# Altium project PCB_Project1.PrjPCB
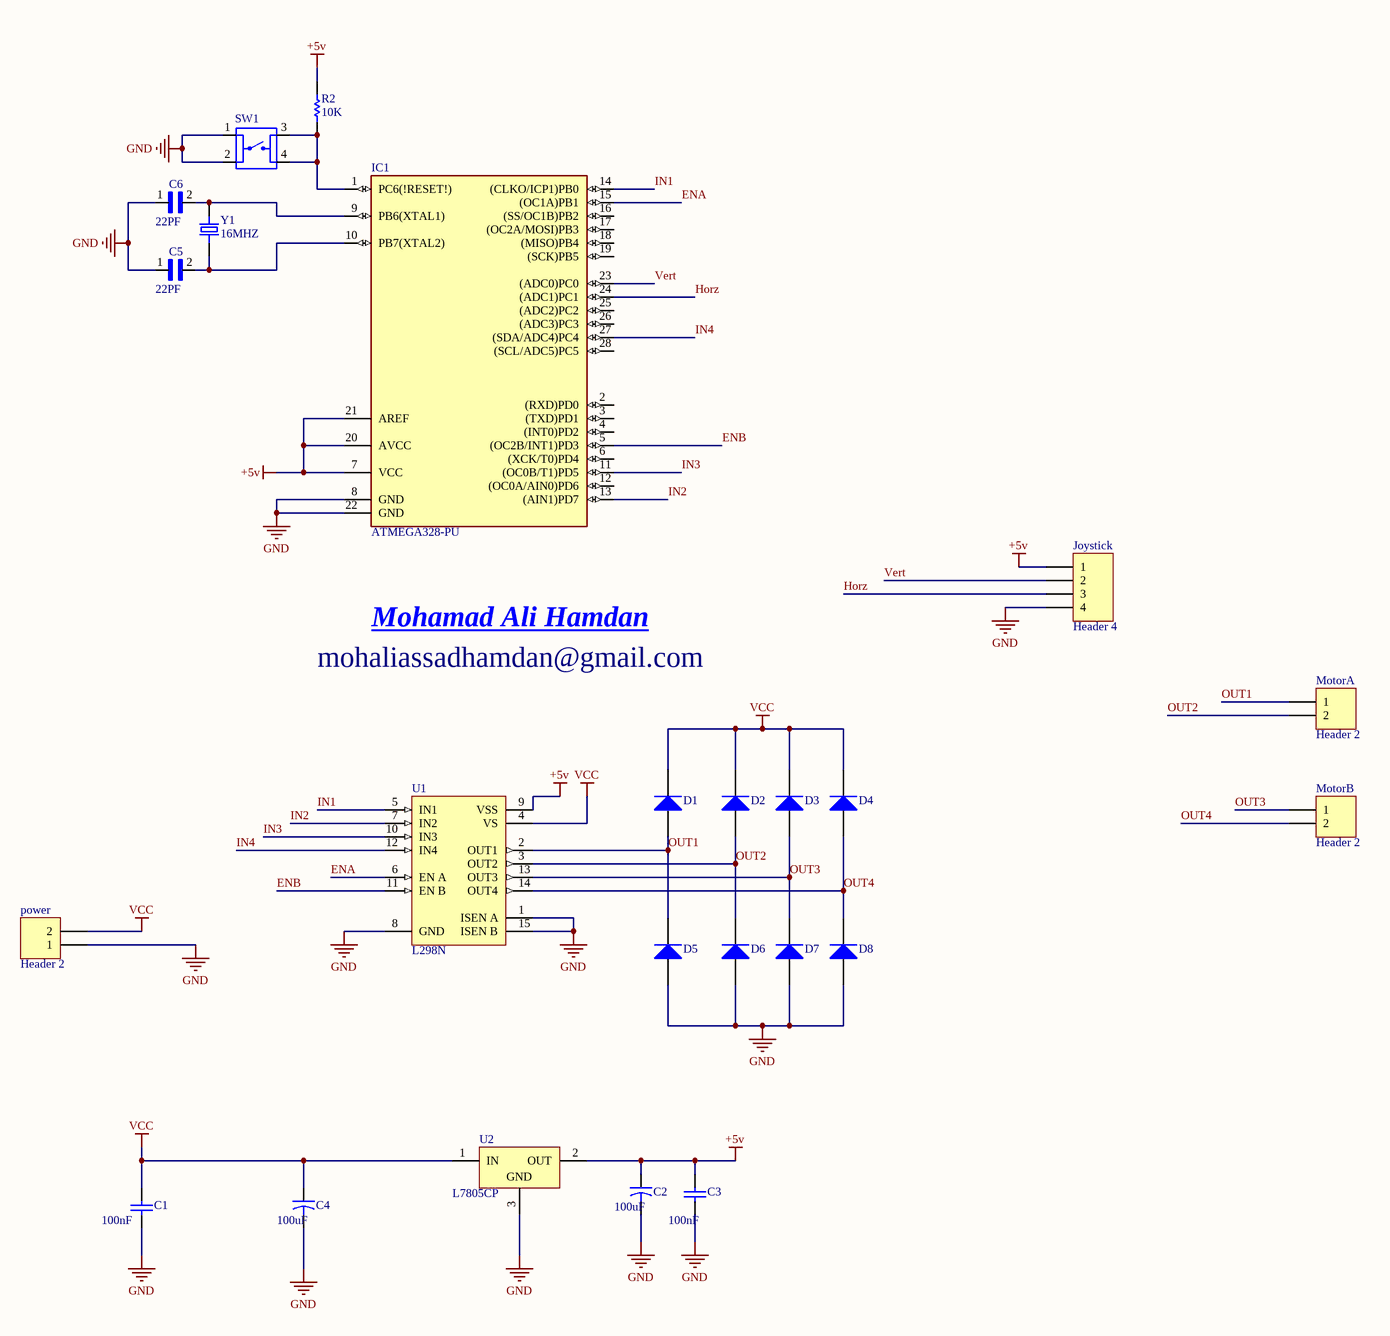
[diagram p0: Sheet1.SchDoc]
1 sheet, 24 parts. Net scope: global (net labels, ports and power ports of the same name join across sheets).
Board file: PCB1.PcbDoc

## Sheet Sheet1.SchDoc
size A3

### Parts
C1  value 100nF  [CAP_RDER71H333K0M1H03A]  (hidden comment: Cap)
C2  value 100uF  [Capacitor_pol]  (hidden comment: Cap2)
C3  value 100nF  [CAP_RDER71H333K0M1H03A]  (hidden comment: Cap)
C4  value 100uF  [Capacitor_pol]  (hidden comment: Cap2)
C5  BuyPart: 22PF  [CAP_RDER71H333K0M1H03A]  (hidden comment: 14pF)
C6  BuyPart: 22PF  [CAP_RDER71H333K0M1H03A]  (hidden comment: 14pF)
D1  Diode 1N914  [diode 4007]  (value not drawn)
D2  Diode 1N914  [diode 4007]  (value not drawn)
D3  Diode 1N914  [diode 4007]  (value not drawn)
D4  Diode 1N914  [diode 4007]  (value not drawn)
D5  Diode 1N914  [diode 4007]  (value not drawn)
D6  Diode 1N914  [diode 4007]  (value not drawn)
D7  Diode 1N914  [diode 4007]  (value not drawn)
D8  Diode 1N914  [diode 4007]  (value not drawn)
IC1  ATMEGA328-PU  [DIL28]
Joystick  Header 4  [TE_2355172-4]
MotorA  Header 2  [blue_connector_2pins]
MotorB  Header 2  [blue_connector_2pins]
power  Header 2  [blue_connector_2pins]
R2  value 10K  [resistor]  (hidden comment: Res1)
SW1  FSM8JH  [SW_FSM8JH]  (value not drawn)
U1  L298N  [TO127P2020X500X2100-15]
U2  L7805CP  [LM7805]
Y1  16MHZ  [XTAL_ECS-160-20-4VX]

### Nets
+5v: C2.1 C3.2 IC1.7(VCC) IC1.20(AVCC) IC1.21(AREF) Joystick.1 R2.2 U1.9(VSS) U2.2(OUT)
GND: C1.1 C2.2 C3.1 C4.2 C5.1 C6.1 D5.1(A) D6.1(A) D7.1(A) D8.1(A) IC1.8(GND) IC1.22(GND) Joystick.4 power.1 SW1.1 SW1.2 U1.1(ISEN_A) U1.8(GND) U1.15(ISEN_B) U2.3(GND)
VCC: C1.2 C4.1 D1.2(K) D2.2(K) D3.2(K) D4.2(K) power.2 U1.4(VS) U2.1(IN)
ENA: IC1.15((OC1A)PB1) U1.6(EN_A)
ENB: IC1.5((OC2B/INT1)PD3) U1.11(EN_B)
Horz: IC1.24((ADC1)PC1) Joystick.3
IN1: IC1.14((CLKO/ICP1)PB0) U1.5(IN1)
IN2: IC1.13((AIN1)PD7) U1.7(IN2)
IN3: IC1.11((OC0B/T1)PD5) U1.10(IN3)
IN4: IC1.27((SDA/ADC4)PC4) U1.12(IN4)
OUT1: D1.1(A) D5.2(K) MotorA.1 U1.2(OUT1)
OUT2: D2.1(A) D6.2(K) MotorA.2 U1.3(OUT2)
OUT3: D3.1(A) D7.2(K) MotorB.1 U1.13(OUT3)
OUT4: D4.1(A) D8.2(K) MotorB.2 U1.14(OUT4)
Vert: IC1.23((ADC0)PC0) Joystick.2
NetC5_2: C5.2 IC1.10(PB7(XTAL2)) Y1.1
NetC6_2: C6.2 IC1.9(PB6(XTAL1)) Y1.2
NetIC1_1: IC1.1(PC6(!RESET!)) R2.1 SW1.3 SW1.4

Not connected (* = marked no-connect by the designer): IC1 2((RXD)PD0) 3((TXD)PD1) 4((INT0)PD2) 6((XCK/T0)PD4) 12((OC0A/AIN0)PD6) 16((SS/OC1B)PB2) 17((OC2A/MOSI)PB3) 18((MISO)PB4) 19((SCK)PB5) 25((ADC2)PC2) 26((ADC3)PC3) 28((SCL/ADC5)PC5)

### Notes on the sheet
- mohaliassadhamdan@gmail.com
- Mohamad Ali Hamdan

### Library data of the parts
C1 C3 = Cap: Capacitor; Published: 8-Jun-2000; LatestRevisionDate: 17-Jul-2002; LatestRevisionNote: Re-released for DXP Platform.; PackageReference: RAD-0.3; Publisher: Altium Limited
C2 C4 = Cap2: Capacitor; Published: 23-Sep-2002; PackageReference: CAPR5-4X5; Publisher: Altium Limited
C5 C6 = RDER71H333K0M1H03A: Lead capacitor X7R(EIA) with Capacitance 33000pF, Rated Voltage 50Vdc; MF: Murata; SnapEDA_Link: https://www.snapeda.com/parts/RDER71H333K0M1H03A/Murata/view-part/4546735/?ref=snap; Availability: Warning; Price: None; Package: Radial Murata; Value: *; MP: RDER71H333K0M1H03A; Mouser-Purchase-URL: https://snapeda.com/shop?store=Mouser&id=4546735
D1-D8 = Diode 1N914: High Conductance Fast Diode; Published: 8-Jun-2000; LatestRevisionDate: 17-Jul-2002; LatestRevisionNote: Re-released for DXP Platform.; DatasheetDocument: 1997; PackageReference: DO-35; Publisher: Altium Limited; Code_JEDEC: DO-204-AH; ComponentLink1Description: Manufacturer Link; ComponentLink1URL: http://www.fairchildsemi.com/; ComponentLink2Description: Datasheet; ComponentLink2URL: http://www.fairchildsemi.com/ds/1N%2F1N4448.pdf
IC1 = ATMEGA328-PU: AVR AVRÂ® ATmega Microcontroller IC 8-Bit 20MHz 32KB _16K x 16_ FLASH 28-PDIP; MF: Microchip Technology; Package: DIP-28 Microchip Technology; Price: None; Availability: Unavailable; MP: ATMEGA328-PU; SnapEDA_Link: https://www.snapeda.com/parts/ATMEGA328-PU/Microchip/view-part/4327846/?ref=snap; Value: *
Joystick = Header 4: Header, 4-Pin; LatestRevisionDate: 17-Jul-2002; LatestRevisionNote: Re-released for DXP Platform.; Publisher: Altium Limited
MotorA MotorB power = Header 2: Header, 2-Pin; LatestRevisionDate: 17-Jul-2002; LatestRevisionNote: Re-released for DXP Platform.; Publisher: Altium Limited
R2 = Res1: Resistor; Published: 8-Jun-2000; LatestRevisionDate: 17-Jul-2002; LatestRevisionNote: Re-released for DXP Platform.; PackageReference: AXIAL-0.3; Publisher: Altium Limited; PackageDescription: Axial Device, Thru-Hole; 2 Leads; 0.3 in Pin Spacing
SW1 = FSM8JH: Tactile Switch SPST-NO Top Actuated Through Hole; MF: TE Connectivity; MP: FSM8JH; SnapEDA_Link: https://www.snapeda.com/parts/FSM8JH/TE%20Connectivity%20ALCOSWITCH%20Switches/view-part/139741/?ref=snap; Price: None; Package: None; TE_purchase_URL: https://www.te.com/usa-en/product-FSM8JH.html?te_bu=Cor&te_type=disp&te_campaign=seda_glo_cor-seda-global-disp-prtnr-fy19-seda-model-bom-cta_sma-317_1&elqCampaignId=32493; Value: *; Availability: Unavailable
U1 = L298N: Dual Full Bridge Driver; Published: 8-Jun-2000; LatestRevisionDate: 14-May-2007; LatestRevisionNote: Mapped to vertical PCB.; DatasheetVersion: Jul-1999; PackageReference: Multiwatt15V; Publisher: Altium Limited; PackageDescription: TO, Thru-Hole, Vertical, Heatsink Mounted; 15 Bent Staggered Leads; Pitch 1.27 mm; ComponentLink1Description: Manufacturer Link; ComponentLink1URL: http://www.st.com/; ComponentLink2Description: Datasheet; ComponentLink2URL: http://www.st.com/stonline/products/literature/ds/1773/l298.pdf
U2 = L7805CP: Positive Voltage Regulator; Note: Tab is connected to pin 3 (GND).; Published: 24-Aug-2001; LatestRevisionDate: 17-Jul-2002; LatestRevisionNote: Re-released for DXP Platform.; DatasheetVersion: Dec-1998; PackageVersion: Jul-1998; PackageReference: ISOWATT220AB; Publisher: Altium Limited; PackageDescription: TO, Thru-Hole, Vertical, Heatsink Mounted; 3 In-Line Leads; Pitch 2.54 mm; Pin sequence 1, 3, 2; ComponentLink1Description: Manufacturer Link; ComponentLink1URL: http://www.st.com/
Y1 = ECS-160-20-4VX: 16MHz Â±30ppm Crystal 20pF 50 Ohms HC-49/US; MF: ECS Inc.; SnapEDA_Link: https://www.snapeda.com/parts/ECS-160-20-4VX/ECS%20Inc./view-part/47293/?ref=snap; Availability: Unavailable; Value: *; Price: None; MP: ECS-160-20-4VX; Package: HC49/US ECS International